# Altium schematic sheet power-v3v8.SchDoc: Power 3.8V
size Letter; CheckedBy: J. Brinton; CompanyName: Signal Laboratories, Inc.; DrawnBy: J. Brinton; Engineer: J. Brinton; Address1: 3479 Edison Way; Address2: Menlo Park CA 94025; Address3: +1 (877) 778-8435; Address4: siglabs.com; Revision: 3; SheetNumber: 3; SheetTotal: 7
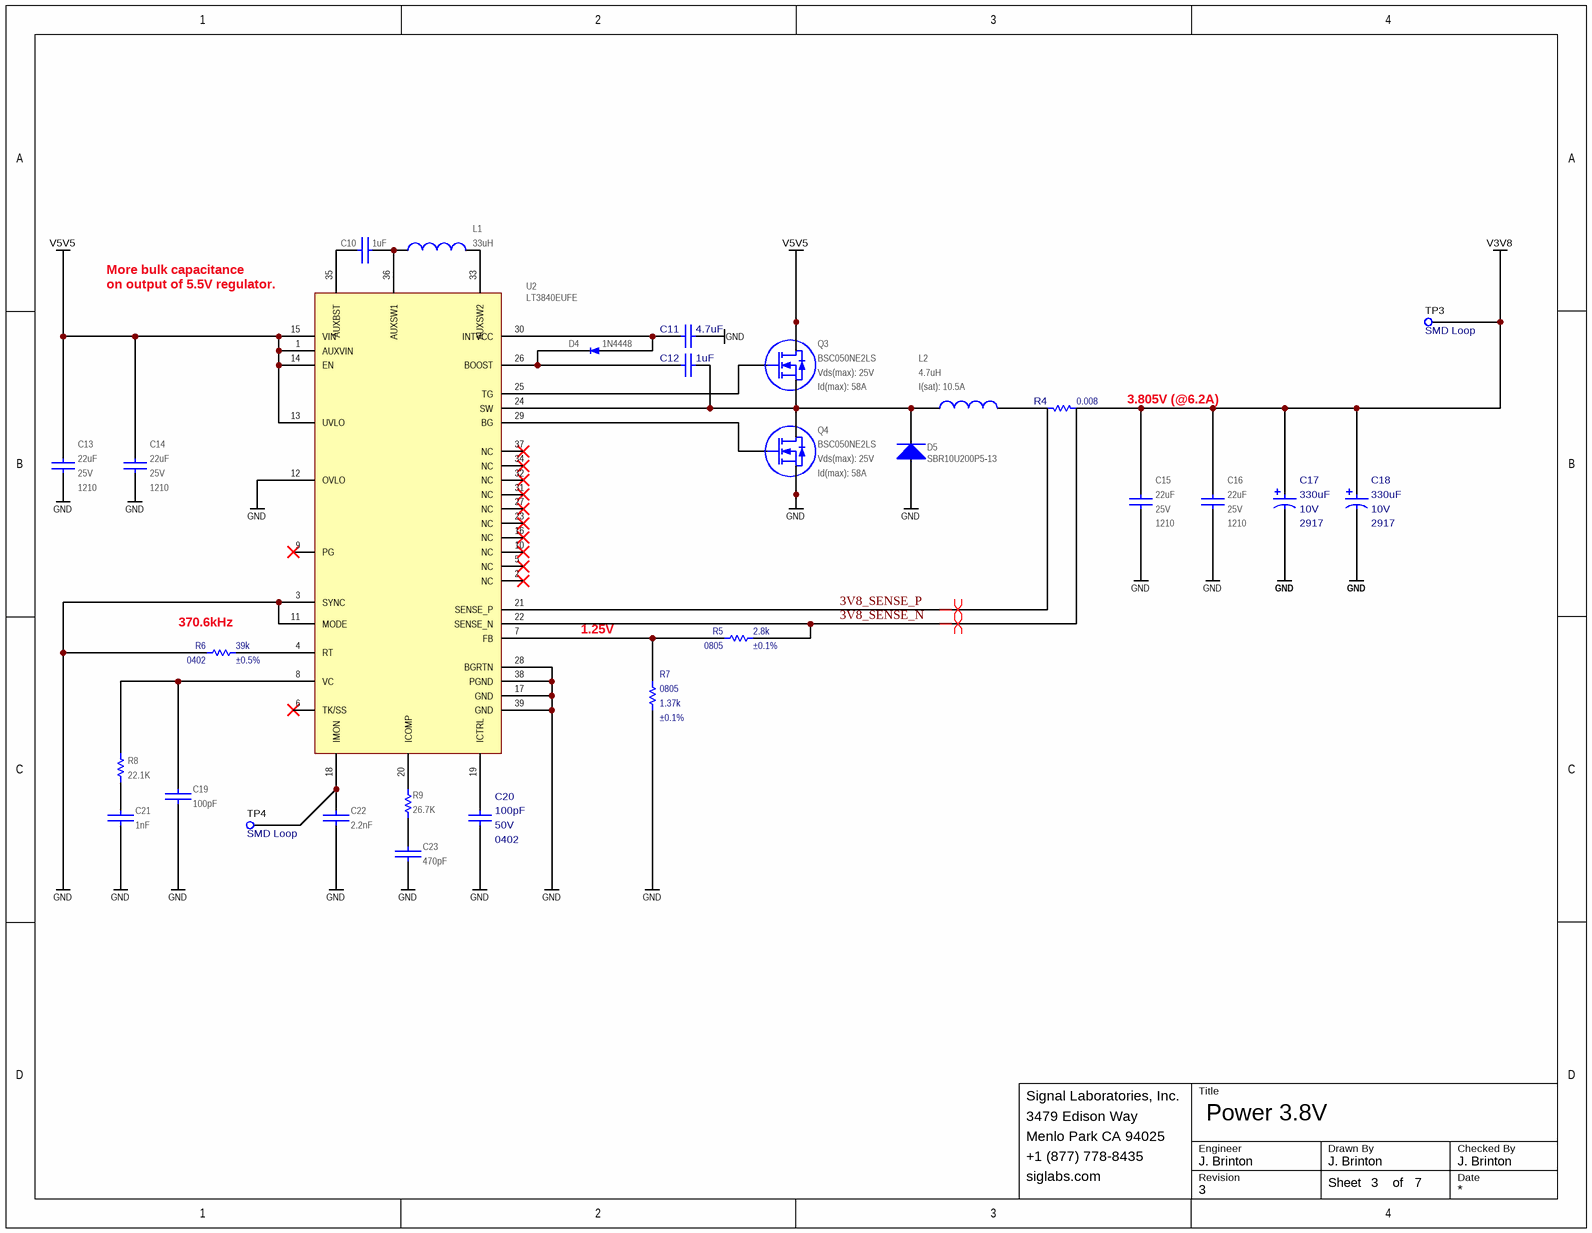
[diagram p0: power-v3v8.SchDoc]

## Parts
C10  value 1uF  [CAPC100X50X55L25N]  (hidden comment: GRM155R61A105KE15)
C11  value 4.7uF  [CAPC160X80X90L20NA]  (hidden comment: CL10A475KA8NQNC)
C12  value 1uF  [CAPC100X50X55L25N]  (hidden comment: GRM155R61A105KE15)
C13  value 22uF  Voltage: 25V  Package: 1210  [CAPC320X250X270L50N]  (hidden comment: GRM32ER71E226KE15)
C14  value 22uF  Voltage: 25V  Package: 1210  [CAPC320X250X270L50N]  (hidden comment: GRM32ER71E226KE15)
C15  value 22uF  Voltage: 25V  Package: 1210  [CAPC320X250X270L50N]  (hidden comment: GRM32ER71E226KE15)
C16  value 22uF  Voltage: 25V  Package: 1210  [CAPC320X250X270L50N]  (hidden comment: GRM32ER71E226KE15)
C17  value 330uF  Package: 2917  Voltage: 10V  [CAPPM730X435X310L135X240N]  (hidden comment: TPSE337K010R0050)
C18  value 330uF  Package: 2917  Voltage: 10V  [CAPPM730X435X310L135X240N]  (hidden comment: TPSE337K010R0050)
C19  value 100pF  [CAPC100X50X55L25N]  (hidden comment: GRM1555C1H101FA01D)
C20  value 100pF  Package: 0402  Voltage: 50V  [CAPC100X50X55L25N]  (hidden comment: VJ0402A101KXA)
C21  value 1nF  [CAPC100X50X55L25N]  (hidden comment: GRM1555C1H102JA01)
C22  value 2.2nF  [CAPC100X50X55L25N]  (hidden comment: C0402C222J3GACTU)
C23  value 470pF  [CAPC100X50X55L25N]  (hidden comment: GRM155R71H471JA01)
D4  Alternative P/N: 1N4448  [SOD323]  (hidden comment: 1N4448HWS-7-F)
D5  SBR10U200P5-13  [DIODES_POWERDI5]
L1  value 33uH  [ME3220]  (hidden comment: ME3220-333KL)
L2  value 4.7uH  I(sat): 10.5A  [XAL6060]  (hidden comment: XAL6060-472ME)
Q3  BSC050NE2LS  Vds(max): 25V  Id(max): 58A  [TDSON-8]
Q4  BSC050NE2LS  Vds(max): 25V  Id(max): 58A  [TDSON-8]
R4  value 0.008  [KRL3216T4]  (hidden comment: KRL3216T4A-M-R008-F)
R5  value 2.8k  Tolerance: ±0.1%  Package: 0805  [RESC2012X70N]  (hidden comment: RT0805BRD072K8L)
R6  value 39k  Tolerance: ±0.5%  Package: 0402  [RESC1005X40N]  (hidden comment: RR0510P-393-D)
R7  value 1.37k  Tolerance: ±0.1%  Package: 0805  [RESC2012X70N]  (hidden comment: RT0805BRD071K37L)
R8  value 22.1K  [RESC1005X40N]  (hidden comment: ERJ-2RKF2212X)
R9  value 26.7K  [RESC1005X40N]  (hidden comment: ERJ-2RKF2672X)
TP3  Notes: SMD Loop  [5015]  (hidden comment: 5015)
TP4  Notes: SMD Loop  [5015]  (hidden comment: 5015)
U2  LT3840EUFE  [QFN39P40_600X400X80L40X20T465X265N]

## Nets
GND: C11.2 C13.1 C14.1 C15.1 C16.1 C17.2 C18.2 C19.1 C20.2 C21.2 C22.2 C23.1 D5.A Q4.1(S) Q4.2(S) Q4.3(S) R6.2 R7.1 U2.3(SYNC) U2.11(MODE) U2.12(OVLO) U2.17(GND) U2.28(BGRTN) U2.38(PGND) U2.39(GND)
V3V8: C15.2 C16.2 C17.1 C18.1 R4.2 TP3.1
V5V5: C13.2 C14.2 Q3.5(D) Q3.6(D) Q3.7(D) Q3.8(D) Q3.9(D) U2.1(AUXVIN) U2.13(UVLO) U2.14(EN) U2.15(VIN)
3V8_SENSE_N: R4.4 R5.1 U2.22(SENSE_N)
3V8_SENSE_P: R4.3 U2.21(SENSE_P)
NetC10_1: C10.1 L1.1 U2.36(AUXSW1)
NetC10_2: C10.2 U2.35(AUXBST)
NetC11_1: C11.1 D4.A U2.30(INTVCC)
NetC12_1: C12.1 D4.K U2.26(BOOST)
NetC12_2: C12.2 D5.K L2.1 Q3.1(S) Q3.2(S) Q3.3(S) Q4.5(D) Q4.6(D) Q4.7(D) Q4.8(D) Q4.9(D) U2.24(SW)
NetC19_2: C19.2 R8.2 U2.8(VC)
NetC20_1: C20.1 U2.19(ICTRL)
NetC21_1: C21.1 R8.1
NetC22_1: C22.1 TP4.1 U2.18(IMON)
NetC23_2: C23.2 R9.2
NetL1_2: L1.2 U2.33(AUXSW2)
NetL2_2: L2.2 R4.1
NetQ3_4: Q3.4(G) U2.25(TG)
NetQ4_4: Q4.4(G) U2.29(BG)
NetR5_2: R5.2 R7.2 U2.7(FB)
NetR6_1: R6.1 U2.4(RT)
NetR9_1: R9.1 U2.20(ICOMP)

Not connected (* = marked no-connect by the designer): U2 2(NC)* 5(NC)* 6(TK/SS)* 9(PG)* 10(NC)* 16(NC)* 23(NC)* 27(NC)* 31(NC)* 32(NC)* 34(NC)* 37(NC)*

## Layout directives
differential pair: 3V8_SENSE_N, 3V8_SENSE_P

## Notes on the sheet
- More bulk capacitance
- (near U2) on output of 5.5V regulator.
- (near R4) 3.805V (@6.2A)
- (near R6) 370.6kHz
- 1.25V
- Title
- Engineer
- Revision
- Drawn By
- Checked By
- Date
- Sheet
- of

## Library data of the parts
C10 = CAP: Ceramic Capacitor 1uF ±10% 10V X5R 0402; Manufacturer: Murata; Tr: -55:125; Manufacturer P/N: GRM155R61A105KE15; Package: 0402; Tolerance: ±10%; Voltage: 10V
C11 = TMK212B7475KG: Ceramic Capacitor 4.7uF ±10% 25V X5R 0603; Manufacturer: Samsung; Tr: -55:85; Manufacturer P/N: CL10A475KA8NQNC; Tolerance: ±10%; Package: 0603; Voltage: 25V
C12 = UMK212B7105KG: Ceramic Capacitor 1uF ±10% 10V X5R 0402; Manufacturer: Murata; Voltage: 50V; Manufacturer P/N: GRM155R61A105KE15; Tolerance: ±10%; Tr: *; Package: 0402
C13-C16 = CAP: Ceramic Capacitor 22uF ±10% 25V X7R 1210; Manufacturer: Murata; Tr: -55:125; Manufacturer P/N: GRM32ER71E226KE15; Tolerance: ±10%
C17 C18 = CAP_POL: Tantalum Capacitor 330uF ±10% 10V 2917; Manufacturer: AVX; Tr: -55:125; Manufacturer P/N: TPSE337K010R0050; Tolerance: ±10%
C19 = CAP: Ceramic Capacitor 100pF ±1% 50V NP0 0402; Manufacturer: Murata; Tr: -55:125; Manufacturer P/N: GRM1555C1H101FA01D; Voltage: 50V; Package: 0402; Tolerance: ±1%
C20 = VJ0402A101KXA: Ceramic Capacitor 100pF ±10% 50V C0G 0402; Manufacturer: Vishay; Tr: -55:150; Manufacturer P/N: VJ0402A101KXA; Tolerance: ±10%
C21 = CAP: Ceramic Capacitor 1nF ±5% 50V NP0 0402; Manufacturer: Murata; Tr: -55:125; Manufacturer P/N: GRM1555C1H102JA01; Voltage: 50V; Package: 0402; Tolerance: ±5%
C22 = CAP: Ceramic Capacitor 2.2nF ±5% 25V NP0 0402; Manufacturer: Kemet; Tr: -55:125; Manufacturer P/N: C0402C222J3GACTU; Package: 0402; Tolerance: ±5%; Voltage: 25V
C23 = CAP: Ceramic Capacitor 470pF ±5% 50V X7R 0402; Manufacturer: Murata; Tr: -55:125; Manufacturer P/N: GRM155R71H471JA01; Voltage: 50V; Package: 0402; Tolerance: ±5%
D4 = 1N4448HWS-7-F: Schottky Diode 80V 250mA SOD323; Manufacturer: Diodes Inc; Manufacturer P/N: 1N4448HWS-7-F; Package: SOD323
D5 = PDS5100H: Schottky Diode 200V 10A SMD; Manufacturer: Diodes Inc; Manufacturer P/N: SBR10U200P5-13; Current: 10A; Reverse Voltage (max): 200V; Package: PowerDi-5
L1 = COIL: Inductor 33uH ±10% 500mA SMD; Manufacturer: Coilcraft; Tr: -40:85; Manufacturer P/N: ME3220-333KL; I(sat): 500mA; Package: *; Tolerance: ±10%
L2 = COIL: Inductor 4.7uH,10.5A(sat), SMD; Manufacturer: Coilcraft; Manufacturer P/N: XAL6060-472ME
Q3 Q4 = BSC190N15NS3: MOSFET N-Channel Enhancement Mode; Manufacturer: Infineon; Rds(on): 5mOhm; Manufacturer P/N: BSC050NE2LS
R4 = KRL3216T4A-M-R009-F: Current Sense Resistor 8 mOhms +/-1% SMD 4-Terminal; Manufacturer: Susumu; Tolerance: ±1%; Tr: -55:+155; Manufacturer P/N: KRL3216T4A-M-R008-F
R5 = RES: Thin Film Resistor 2.8k +/-0.1% SMD 0805; Manufacturer: Yageo; Tr: -55:155; Tcr: *; Manufacturer P/N: RT0805BRD072K8L; Alternatives: *; Voltage: *; Power: *
R6 = RES: Thin Film Resistor 39k +/-0.5% SMD 0402; Manufacturer: Susumu; Tr: -55:155; Tcr: *; Manufacturer P/N: RR0510P-393-D; Alternatives: *; Voltage: *; Power: *
R7 = RES: Thin Film Resistor 1.37k +/-0.1% SMD 0805; Manufacturer: Yageo; Tr: -55:155; Tcr: *; Manufacturer P/N: RT0805BRD071K37L; Alternatives: *; Voltage: *; Power: *
R8 = RES 0402: Thick Film Resistor 22.1k ±1% 0402; Manufacturer: Panasonic; Tr: -55:155; Package: 0402; Manufacturer P/N: ERJ-2RKF2212X; Tolerance: ±1%
R9 = RES 0402: Thick Film Resistor 26.7k ±1% 0402; Manufacturer: Panasonic; Tr: -55:155; Package: 0402; Manufacturer P/N: ERJ-2RKF2672X; Tolerance: ±1%
TP3 TP4 = TEST_POINT_SMD_50: Test Point SMD; Manufacturer: Keystone; Manufacturer P/N: 5015
U2 = LT3840EUFE: Synchronous Regulator Controller; Manufacturer: Linear Technology; Alternative P/N: LT3840IUFE; Manufacturer P/N: LT3840EUFE